# EAGLE schematic Rapid_Prototype_Schematic (EAGLE 9.6.2)

## Sheet 1 of 5
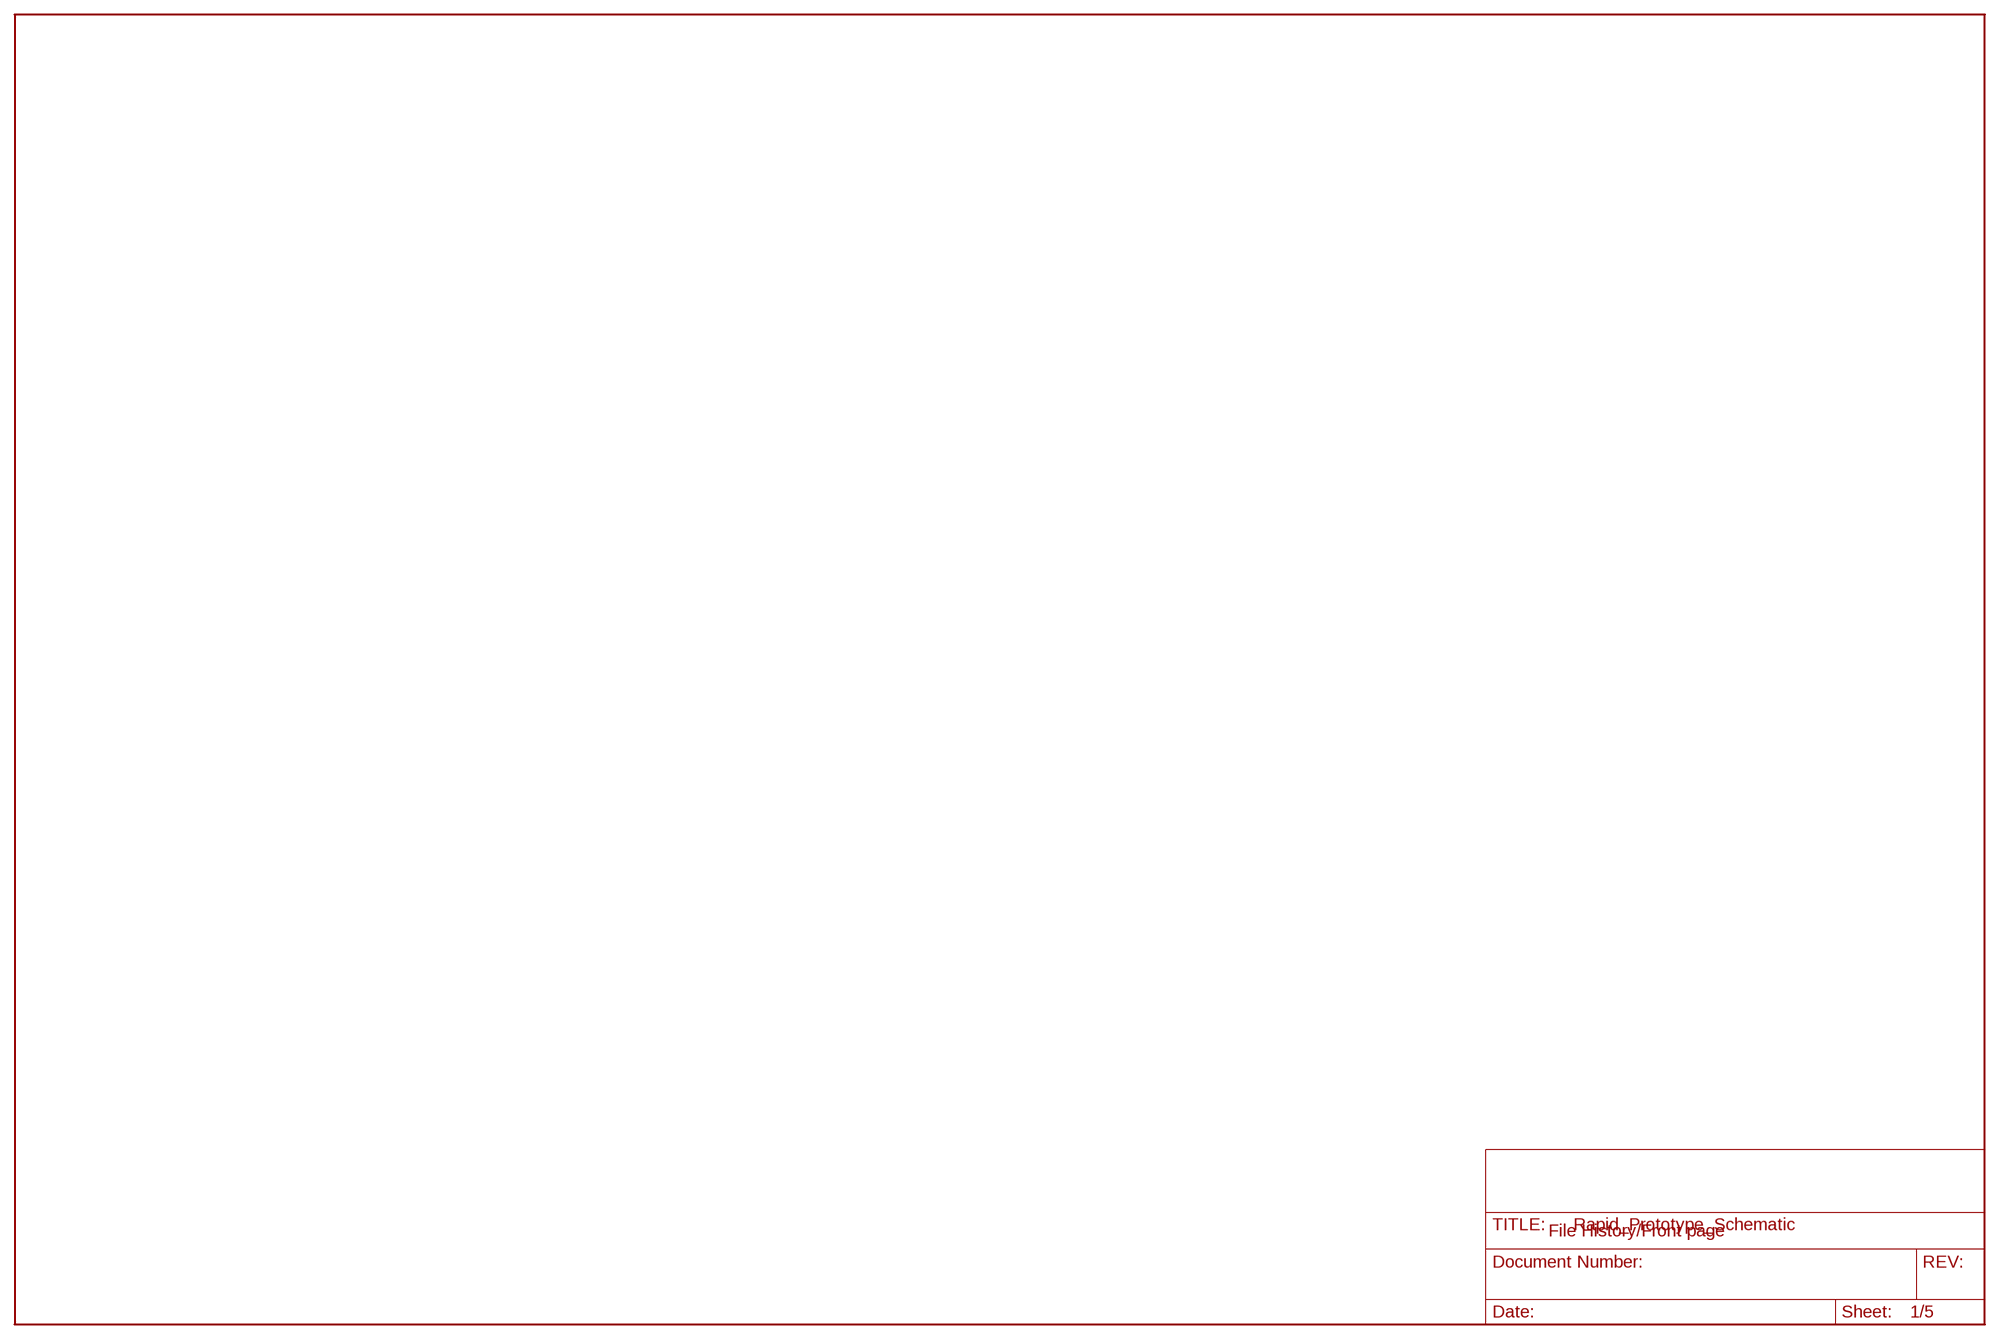
[diagram p0: schematic, sheet 1]

### Notes on the sheet
- File History/Front page

## Sheet 2 of 5
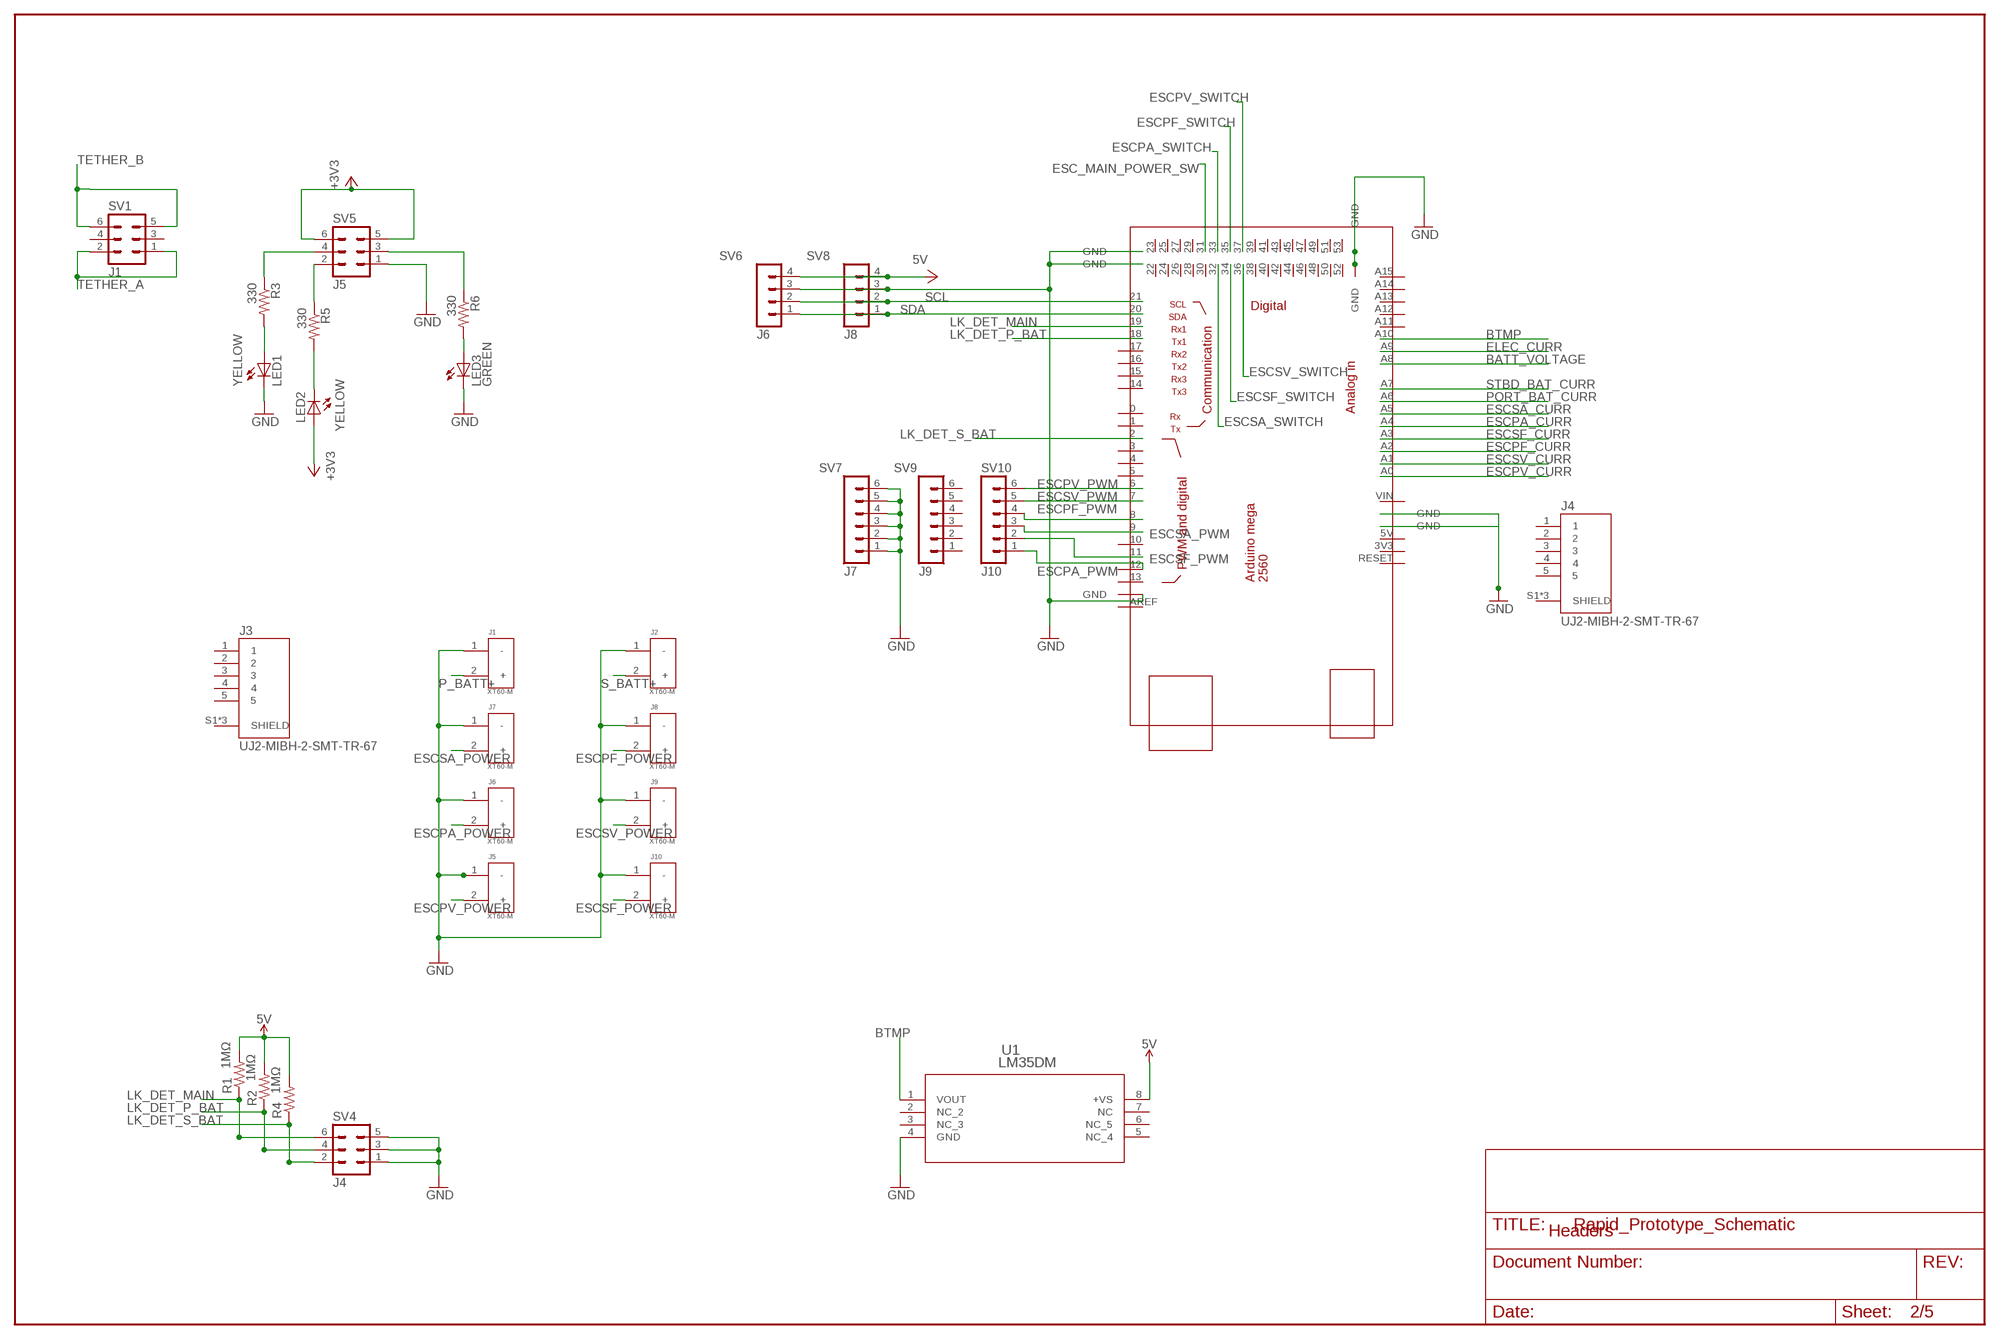
[diagram p1: schematic, sheet 2]

### Parts
$2_3_$_2020-06-04_21-52-10  MEGA_DEVICE  [MEGAOUTLINE]
J1  XT60-M  [AMASS_XT60-M]
J2  XT60-M  [AMASS_XT60-M]
J3  UJ2-MIBH-2-SMT-TR-67  [CUI_UJ2-MIBH-2-SMT-TR-67]
J4  UJ2-MIBH-2-SMT-TR-67  [CUI_UJ2-MIBH-2-SMT-TR-67]
J5  XT60-M  [AMASS_XT60-M]
J6  XT60-M  [AMASS_XT60-M]
J7  XT60-M  [AMASS_XT60-M]
J8  XT60-M  [AMASS_XT60-M]
J9  XT60-M  [AMASS_XT60-M]
J10  XT60-M  [AMASS_XT60-M]
LED1  YELLOW  LEDCHIPLED_0805  [CHIPLED_0805]
LED2  YELLOW  LEDCHIPLED_0805  [CHIPLED_0805]
LED3  GREEN  LEDCHIPLED_0805  [CHIPLED_0805]
R1  1MΩ  R-US_M0805  [M0805]
R2  1MΩ  R-US_M0805  [M0805]
R3  330  R-US_R0805  [R0805]
R4  1MΩ  R-US_M0805  [M0805]
R5  330  R-US_R0805  [R0805]
R6  330  R-US_R0805  [R0805]
SV1  J1  MA03-2  [MA03-2]
SV4  J4  MA03-2  [MA03-2]
SV5  J5  MA03-2  [MA03-2]
SV6  J6  MA04-1  [MA04-1]
SV7  J7  MA06-1  [MA06-1]
SV8  J8  MA04-1  [MA04-1]
SV9  J9  MA06-1  [MA06-1]
SV10  J10  MA06-1  [MA06-1]
U1  LM35DM  [M08A]

### Nets
5V: R1.2 R2.2 R4.2 U1.8(+VS) ; also sheet 3,4
+3V3: LED2.A SV5.5 SV5.6 ; also sheet 4
+5V: SV6.4 SV8.4 ; supply symbol labelled 5V ; also sheet 4
BATT_VOLTAGE: $2_3_$_2020-06-04_21-52-10.A8 ; also sheet 4
BTMP: $2_3_$_2020-06-04_21-52-10.A10 U1.1(VOUT)
ELEC_CURR: $2_3_$_2020-06-04_21-52-10.A9 ; also sheet 3
ESC_MAIN_POWER_SW: $2_3_$_2020-06-04_21-52-10.31 ; also sheet 5
ESCPA_CURR: $2_3_$_2020-06-04_21-52-10.A4 ; also sheet 3
ESCPA_POWER: J6.2(+) ; also sheet 5
ESCPA_PWM: $2_3_$_2020-06-04_21-52-10.12 SV10.1
ESCPA_SWITCH: $2_3_$_2020-06-04_21-52-10.33 ; also sheet 5
ESCPF_CURR: $2_3_$_2020-06-04_21-52-10.A2 ; also sheet 3
ESCPF_POWER: J8.2(+) ; also sheet 5
ESCPF_PWM: $2_3_$_2020-06-04_21-52-10.8 SV10.4
ESCPF_SWITCH: $2_3_$_2020-06-04_21-52-10.35 ; also sheet 5
ESCPV_CURR: $2_3_$_2020-06-04_21-52-10.A0 ; also sheet 3
ESCPV_POWER: J5.2(+) ; also sheet 5
ESCPV_PWM: $2_3_$_2020-06-04_21-52-10.6 SV10.6
ESCPV_SWITCH: $2_3_$_2020-06-04_21-52-10.37 ; also sheet 5
ESCSA_CURR: $2_3_$_2020-06-04_21-52-10.A5 ; also sheet 3
ESCSA_POWER: J7.2(+) ; also sheet 5
ESCSA_PWM: $2_3_$_2020-06-04_21-52-10.9 SV10.3
ESCSA_SWITCH: $2_3_$_2020-06-04_21-52-10.32 ; also sheet 5
ESCSF_CURR: $2_3_$_2020-06-04_21-52-10.A3 ; also sheet 3
ESCSF_POWER: J10.2(+) ; also sheet 5
ESCSF_PWM: $2_3_$_2020-06-04_21-52-10.11 SV10.2
ESCSF_SWITCH: $2_3_$_2020-06-04_21-52-10.34 ; also sheet 5
ESCSV_CURR: $2_3_$_2020-06-04_21-52-10.A1 ; also sheet 3
ESCSV_POWER: J9.2(+) ; also sheet 5
ESCSV_PWM: $2_3_$_2020-06-04_21-52-10.7 SV10.5
ESCSV_SWITCH: $2_3_$_2020-06-04_21-52-10.36 ; also sheet 5
GND: $2_3_$_2020-06-04_21-52-10.GND@1(GND) $2_3_$_2020-06-04_21-52-10.GND@2(GND) $2_3_$_2020-06-04_21-52-10.GND@3(GND) $2_3_$_2020-06-04_21-52-10.GND@4(GND) $2_3_$_2020-06-04_21-52-10.GND@5(GND) $2_3_$_2020-06-04_21-52-10.GND@6(GND) $2_3_$_2020-06-04_21-52-10.GND@7(GND) J1.1(-) J2.1(-) J5.1(-) J6.1(-) J7.1(-) J8.1(-) J9.1(-) J10.1(-) LED1.C LED3.C SV4.1 SV4.3 SV4.5 SV5.1 SV6.3 SV7.1 SV7.2 SV7.3 SV7.4 SV7.5 SV7.6 SV8.3 U1.4(GND) ; also sheet 3,4,5
LK_DET_MAIN: $2_3_$_2020-06-04_21-52-10.19 R1.1 SV4.6
LK_DET_P_BAT: $2_3_$_2020-06-04_21-52-10.18 R2.1 SV4.4
LK_DET_S_BAT: $2_3_$_2020-06-04_21-52-10.2 R4.1 SV4.2
N$53: R3.1 SV5.4
N$54: LED2.C R5.2
N$55: R5.1 SV5.2
N$56: LED1.A R3.2
N$57: R6.1 SV5.3
N$58: LED3.A R6.2
P_BATT+: J1.2(+) ; also sheet 4
PORT_BAT_CURR: $2_3_$_2020-06-04_21-52-10.A6 ; also sheet 4
S_BATT+: J2.2(+) ; also sheet 4
SCL: $2_3_$_2020-06-04_21-52-10.21 SV6.2 SV8.2
SDA: $2_3_$_2020-06-04_21-52-10.20 SV6.1 SV8.1
STBD_BAT_CURR: $2_3_$_2020-06-04_21-52-10.A7 ; also sheet 4
TETHER_A: SV1.1 SV1.2 ; also sheet 4
TETHER_B: SV1.5 SV1.6 ; also sheet 4
Unconnected: $2_3_$_2020-06-04_21-52-10.0 $2_3_$_2020-06-04_21-52-10.1 $2_3_$_2020-06-04_21-52-10.3 $2_3_$_2020-06-04_21-52-10.3V3 $2_3_$_2020-06-04_21-52-10.4 $2_3_$_2020-06-04_21-52-10.5 $2_3_$_2020-06-04_21-52-10.5V $2_3_$_2020-06-04_21-52-10.10 $2_3_$_2020-06-04_21-52-10.13 $2_3_$_2020-06-04_21-52-10.14 $2_3_$_2020-06-04_21-52-10.15 $2_3_$_2020-06-04_21-52-10.16 $2_3_$_2020-06-04_21-52-10.17 $2_3_$_2020-06-04_21-52-10.22 $2_3_$_2020-06-04_21-52-10.23 $2_3_$_2020-06-04_21-52-10.24 $2_3_$_2020-06-04_21-52-10.25 $2_3_$_2020-06-04_21-52-10.26 $2_3_$_2020-06-04_21-52-10.27 $2_3_$_2020-06-04_21-52-10.28 $2_3_$_2020-06-04_21-52-10.29 $2_3_$_2020-06-04_21-52-10.30 $2_3_$_2020-06-04_21-52-10.38 $2_3_$_2020-06-04_21-52-10.39 $2_3_$_2020-06-04_21-52-10.40 $2_3_$_2020-06-04_21-52-10.41 $2_3_$_2020-06-04_21-52-10.42 $2_3_$_2020-06-04_21-52-10.43 $2_3_$_2020-06-04_21-52-10.44 $2_3_$_2020-06-04_21-52-10.45 $2_3_$_2020-06-04_21-52-10.46 $2_3_$_2020-06-04_21-52-10.47 $2_3_$_2020-06-04_21-52-10.48 $2_3_$_2020-06-04_21-52-10.49 $2_3_$_2020-06-04_21-52-10.50 $2_3_$_2020-06-04_21-52-10.51 $2_3_$_2020-06-04_21-52-10.52 $2_3_$_2020-06-04_21-52-10.53 $2_3_$_2020-06-04_21-52-10.A11 $2_3_$_2020-06-04_21-52-10.A12 $2_3_$_2020-06-04_21-52-10.A13 $2_3_$_2020-06-04_21-52-10.A14 $2_3_$_2020-06-04_21-52-10.A15 $2_3_$_2020-06-04_21-52-10.AREF $2_3_$_2020-06-04_21-52-10.RESET $2_3_$_2020-06-04_21-52-10.VIN J3.1 J3.2 J3.3 J3.4 J3.5 J3.S1(SHIELD) J3.S2(SHIELD) J3.S3(SHIELD) J4.1 J4.2 J4.3 J4.4 J4.5 J4.S1(SHIELD) J4.S2(SHIELD) J4.S3(SHIELD) SV1.3 SV1.4 SV9.1 SV9.2 SV9.3 SV9.4 SV9.5 SV9.6 U1.2(NC_2) U1.3(NC_3) U1.5(NC_4) U1.6(NC_5) U1.7(NC)

### Notes on the sheet
- Headers

## Sheet 3 of 5
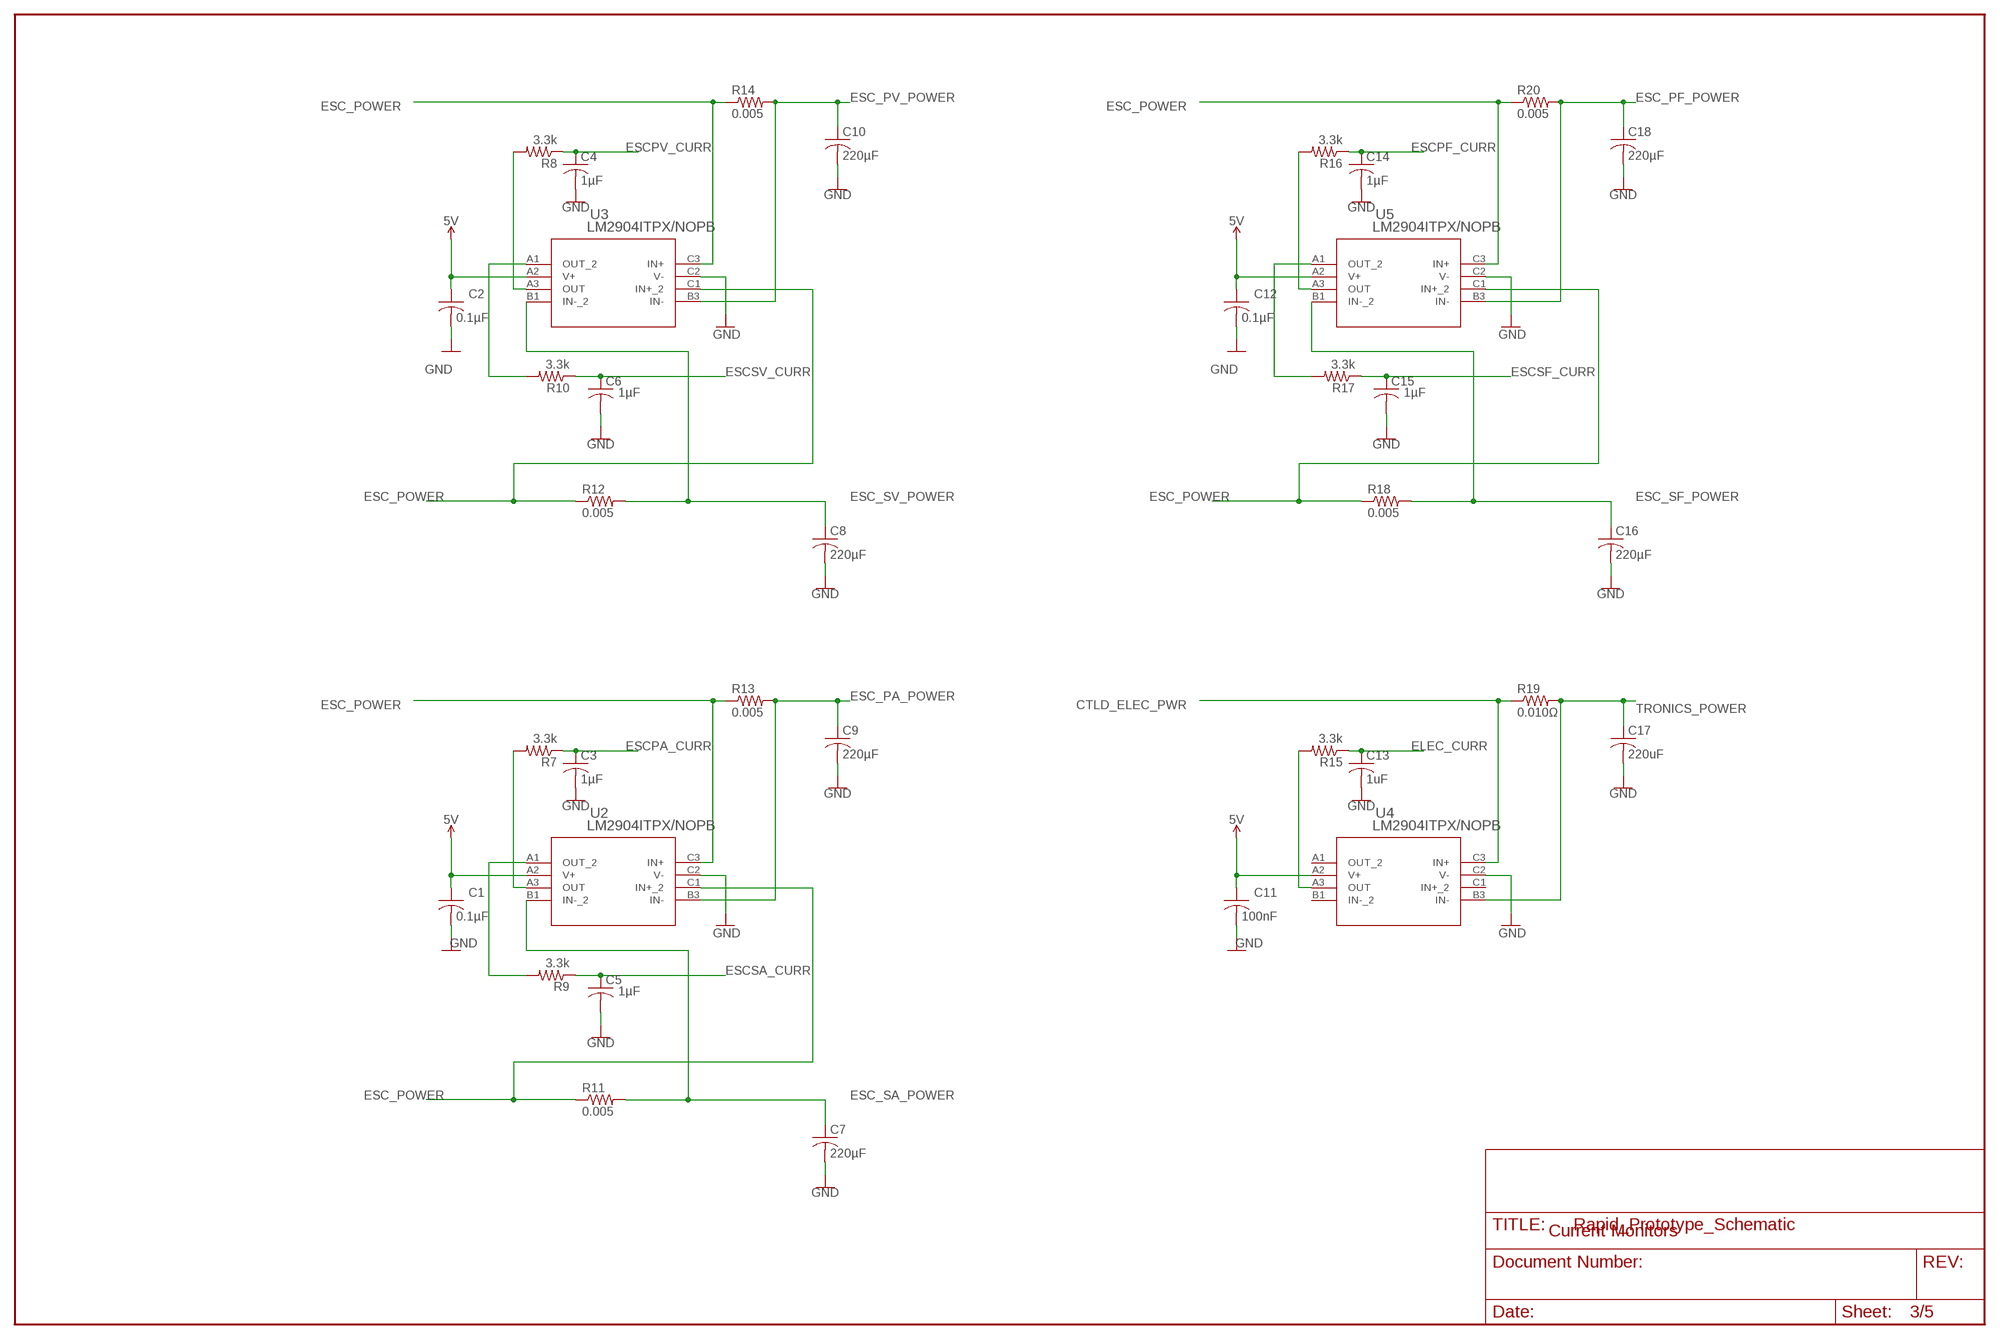
[diagram p2: schematic, sheet 3]

### Parts
C1  0.1µF  C-USC0603  [C0603]
C2  0.1µF  C-USC0603  [C0603]
C3  1µF  C-USC0805  [C0805]
C4  1µF  C-USC0805  [C0805]
C5  1µF  C-USC0805  [C0805]
C6  1µF  C-USC0805  [C0805]
C7  220µF  C-US050-050X075  [C050-050X075]
C8  220µF  C-US050-050X075  [C050-050X075]
C9  220µF  C-US050-050X075  [C050-050X075]
C10  220µF  C-US050-050X075  [C050-050X075]
C11  100nF  C-USC0603  [C0603]
C12  0.1µF  C-USC0603  [C0603]
C13  1uF  C-USC0805  [C0805]
C14  1µF  C-USC0805  [C0805]
C15  1µF  C-USC0805  [C0805]
C16  220µF  C-US050-050X075  [C050-050X075]
C17  220uF  C-US050-050X075  [C050-050X075]
C18  220µF  C-US050-050X075  [C050-050X075]
R7  3.3k  R-US_R0603  [R0603]
R8  3.3k  R-US_R0603  [R0603]
R9  3.3k  R-US_R0603  [R0603]
R10  3.3k  R-US_R0603  [R0603]
R11  0.005  R-US_R1206  [R1206]
R12  0.005  R-US_R1206  [R1206]
R13  0.005  R-US_R1206  [R1206]
R14  0.005  R-US_R1206  [R1206]
R15  3.3k  R-US_R0603  [R0603]
R16  3.3k  R-US_R0603  [R0603]
R17  3.3k  R-US_R0603  [R0603]
R18  0.005  R-US_R1206  [R1206]
R19  0.010Ω  R-US_R1206  [R1206]
R20  0.005  R-US_R1206  [R1206]
U2  LM2904ITPX/NOPB  [TPA08AAA]
U3  LM2904ITPX/NOPB  [TPA08AAA]
U4  LM2904ITPX/NOPB  [TPA08AAA]
U5  LM2904ITPX/NOPB  [TPA08AAA]

### Nets
5V: C1.1 C2.1 C11.1 C12.1 U2.A2(V+) U3.A2(V+) U4.A2(V+) U5.A2(V+) ; also sheet 2,4
CTLD_ELEC_PWR: R19.1 U4.C3(IN+) ; also sheet 4
ELEC_CURR: C13.1 R15.1 ; also sheet 2
ESC_PA_POWER: C9.1 R13.2 U2.B3(IN-) ; also sheet 5
ESC_PF_POWER: C18.1 R20.2 U5.B3(IN-) ; also sheet 5
ESC_POWER: R11.1 R12.1 R13.1 R14.1 R18.1 R20.1 U2.C1(IN+_2) U2.C3(IN+) U3.C1(IN+_2) U3.C3(IN+) U5.C1(IN+_2) U5.C3(IN+) ; also sheet 5
ESC_PV_POWER: C10.1 R14.2 U3.B3(IN-) ; also sheet 5
ESC_SA_POWER: C7.1 R11.2 U2.B1(IN-_2) ; also sheet 5
ESC_SF_POWER: C16.1 R18.2 U5.B1(IN-_2) ; also sheet 5
ESC_SV_POWER: C8.1 R12.2 U3.B1(IN-_2) ; also sheet 5
ESCPA_CURR: C3.1 R7.1 ; also sheet 2
ESCPF_CURR: C14.1 R16.1 ; also sheet 2
ESCPV_CURR: C4.1 R8.1 ; also sheet 2
ESCSA_CURR: C5.1 R9.1 ; also sheet 2
ESCSF_CURR: C15.1 R17.1 ; also sheet 2
ESCSV_CURR: C6.1 R10.1 ; also sheet 2
GND: C1.2 C2.2 C3.2 C4.2 C5.2 C6.2 C7.2 C8.2 C9.2 C10.2 C11.2 C12.2 C13.2 C14.2 C15.2 C16.2 C17.2 C18.2 U2.C2(V-) U3.C2(V-) U4.C2(V-) U5.C2(V-) ; also sheet 2,4,5
N$1: R8.2 U3.A3(OUT)
N$2: R16.2 U5.A3(OUT)
N$5: R10.2 U3.A1(OUT_2)
N$7: R17.2 U5.A1(OUT_2)
N$9: R7.2 U2.A3(OUT)
N$11: R9.2 U2.A1(OUT_2)
N$36: R15.2 U4.A3(OUT)
TRONICS_POWER: C17.1 R19.2 U4.B3(IN-) ; also sheet 4
Unconnected: U4.A1(OUT_2) U4.B1(IN-_2) U4.C1(IN+_2)

### Notes on the sheet
- Current Monitors

## Sheet 4 of 5
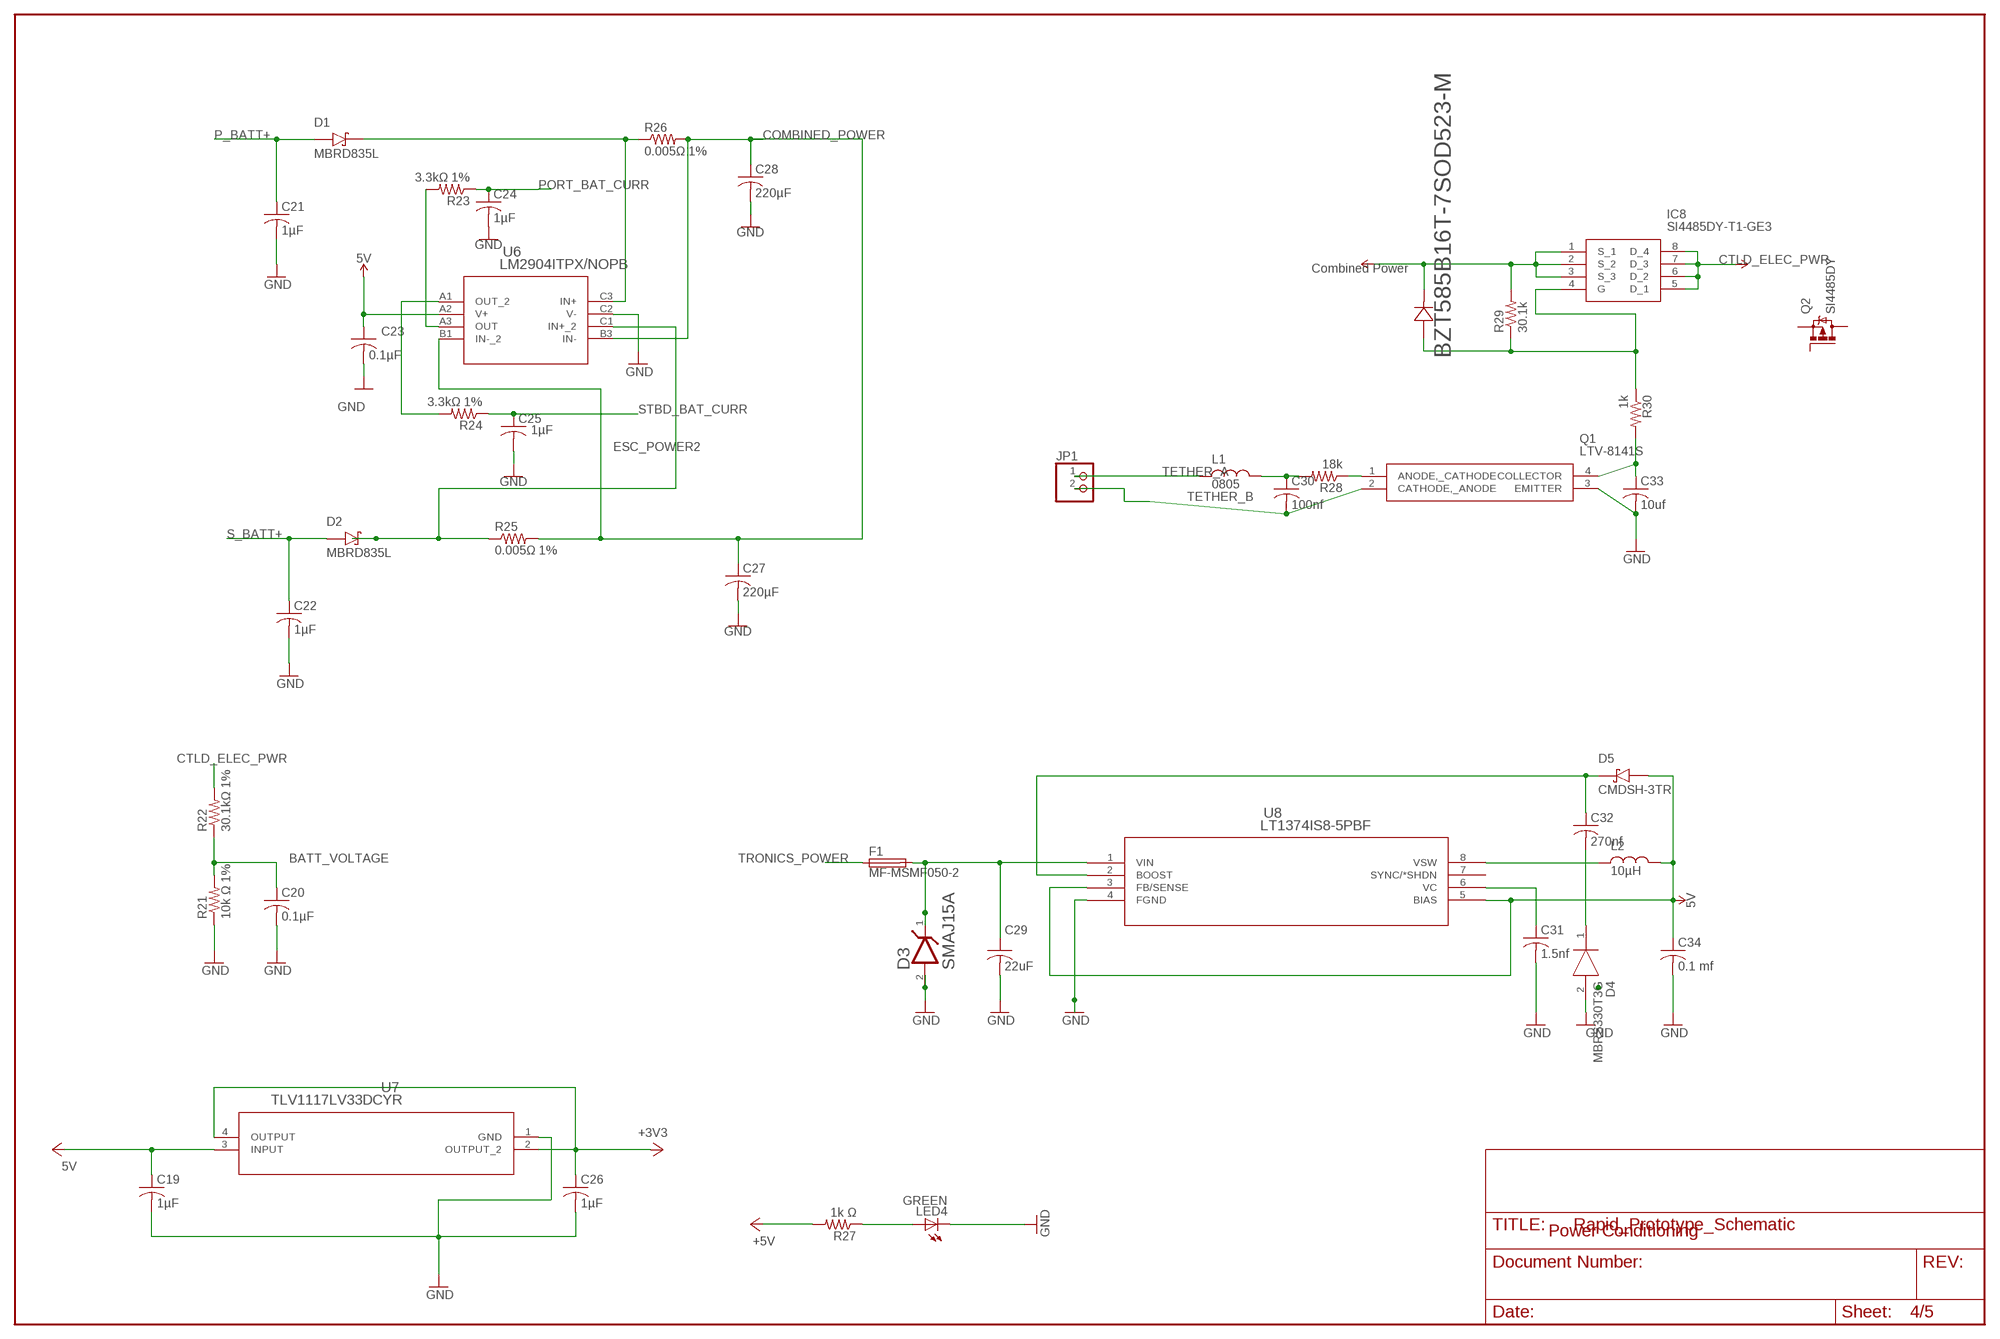
[diagram p3: schematic, sheet 4]

### Parts
C19  1µF  C-USC0805  [C0805]
C20  0.1µF  C-USC0603  [C0603]
C21  1µF  C-USC0603  [C0603]
C22  1µF  C-USC0603  [C0603]
C23  0.1µF  C-USC0603  [C0603]
C24  1µF  C-USC0805  [C0805]
C25  1µF  C-USC0805  [C0805]
C26  1µF  C-USC0805  [C0805]
C27  220µF  C-US050-050X075  [C050-050X075]
C28  220µF  C-US050-050X075  [C050-050X075]
C29  22uF  C-USC1206  [C1206]
C30  100nf  C-USC0603  [C0603]
C31  1.5nf  C-USC1206  [C1206]
C32  270nf  C-USC0603  [C0603]
C33  10uf  C-USC0603  [C0603]
C34  0.1 mf  C-USC0603  [C0603]
CR1  BZT585B16T-7SOD523-M  [SOD523-M]
D1  MBRD835L  [DPAK229P990X238-3N]
D2  MBRD835L  [DPAK229P990X238-3N]
D3  BOURNS_INC._SMAJ15ABOURNS_INC._SMAJ15A_0_0  [BOURNS_INC._SMAJ15A_0]
D4  MBRS330T3G  [DIOM7958X256N]
D5  CMDSH-3TR  [SOD2512X110N]
F1  MF-MSMF050-2  [FUSM1812X02]
IC8  SI4485DY-T1-GE3  [SOIC127P600X175-8N]
JP1  PINHD-1X2  [1X02]
L1  0805  L  (no package)
L2  10µH  L  (no package)
LED4  GREEN  LEDCHIPLED_0805  [CHIPLED_0805]
Q1  LTV-8141S  [SOP254P1016X460-4N]
R21  10k Ω 1%  R-US_M0805  [M0805]
R22  30.1kΩ 1%  R-US_M0805  [M0805]
R23  3.3kΩ 1%  R-US_R0603  [R0603]
R24  3.3kΩ 1%  R-US_R0603  [R0603]
R25  0.005Ω 1%  R-US_R1206  [R1206]
R26  0.005Ω 1%  R-US_R1206  [R1206]
R27  1k Ω  R-US_M0805  [M0805]
R28  18k  R-US_M0805  [M0805]
R29  30.1k  R-US_M0805  [M0805]
R30  1k  R-US_M0805  [M0805]
U6  LM2904ITPX/NOPB  [TPA08AAA]
U7  TLV1117LV33DCYR  [DCY4]
U8  LT1374IS8-5PBF  [SO-8_S]

### Nets
5V: C23.1 C34.1 CR1.1 D5.A IC8.1(S_1) IC8.2(S_2) IC8.3(S_3) IC8.5(D_1) IC8.6(D_2) IC8.7(D_3) IC8.8(D_4) L2.2 R29.2 U6.A2(V+) U8.3(FB/SENSE) U8.5(BIAS) ; supply symbol labelled Combined Power, CTLD_ELEC_PWR ; also sheet 2,3
+3V3: C26.1 U7.2(OUTPUT_2) U7.4(OUTPUT) ; also sheet 2
+5V: C19.1 R27.2 U7.3(INPUT) ; supply symbol labelled 5V ; also sheet 2
BATT_VOLTAGE: C20.1 R21.2 R22.1 ; also sheet 2
COMBINED_POWER: C27.1 C28.1 R25.2 R26.2 U6.B1(IN-_2) U6.B3(IN-) ; also sheet 5
CTLD_ELEC_PWR: R22.2 ; also sheet 3
ESC_POWER1: D1.4(K) R26.1 U6.C3(IN+)
ESC_POWER2: D2.4(K) R25.1 U6.C1(IN+_2)
GND: C19.2 C20.2 C21.2 C22.2 C23.2 C24.2 C25.2 C26.2 C27.2 C28.2 C29.2 C31.2 C33.2 C34.2 D3.2(ANODE) D4.2(A) LED4.C Q1.3(EMITTER) R21.1 U6.C2(V-) U7.1(GND) U8.4(FGND) ; also sheet 2,3,5
N$3: L2.1 U8.8(VSW)
N$4: C31.1 U8.6(VC)
N$8: C32.2 D4.1(K)
N$16: Q1.1(ANODE,_CATHODE) R28.1
N$34: R23.2 U6.A3(OUT)
N$35: R24.2 U6.A1(OUT_2)
N$37: C29.1 D3.1(CATHODE) F1.2 U8.1(VIN)
N$38: C32.1 D5.C U8.2(BOOST)
N$39: LED4.A R27.1
N$43: CR1.2 IC8.4(G) R29.1 R30.1
N$44: C33.1 Q1.4(COLLECTOR) R30.2
N$48: C30.1 L1.2 R28.2
P_BATT+: C21.1 D1.1(A) D1.3(A) ; also sheet 2
PORT_BAT_CURR: C24.1 R23.1 ; also sheet 2
S_BATT+: C22.1 D2.1(A) D2.3(A) ; also sheet 2
STBD_BAT_CURR: C25.1 R24.1 ; also sheet 2
TETHER_A: JP1.1 L1.1 ; also sheet 2
TETHER_B: C30.2 JP1.2 Q1.2(CATHODE,_ANODE) ; also sheet 2
TRONICS_POWER: F1.1 ; also sheet 3
Unconnected: U8.7(SYNC/*SHDN)

### Notes on the sheet
- Power Conditioning

## Sheet 5 of 5
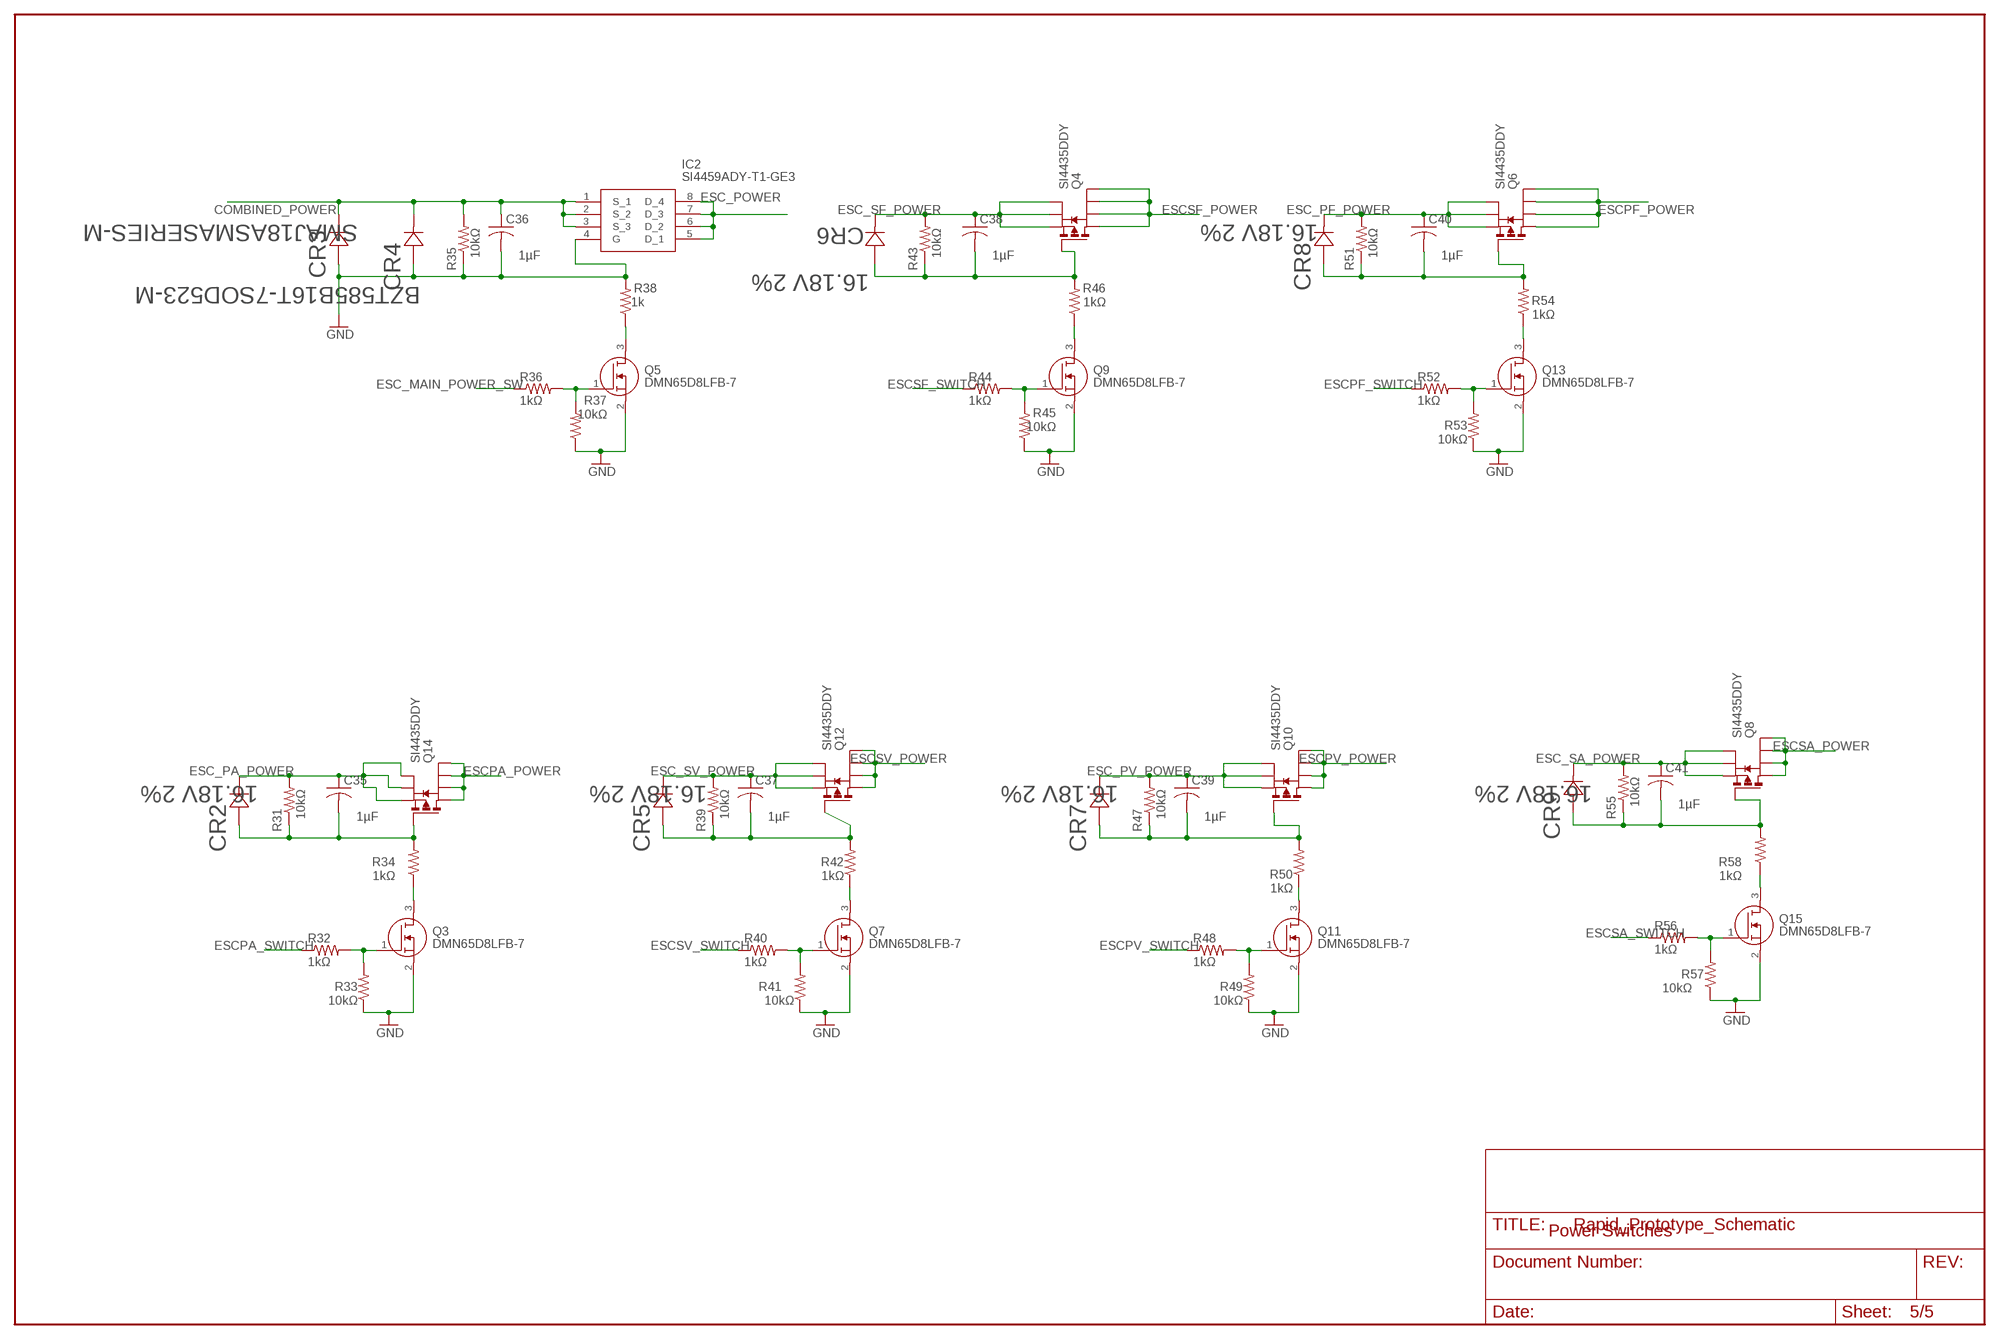
[diagram p4: schematic, sheet 5]

### Parts
C35  1µF  C-USC0805  [C0805]
C36  1µF  C-USC0805  [C0805]
C37  1µF  C-USC0805  [C0805]
C38  1µF  C-USC0805  [C0805]
C39  1µF  C-USC0805  [C0805]
C40  1µF  C-USC0805  [C0805]
C41  1µF  C-USC0805  [C0805]
CR2  16.18V 2%  BZT585B16T-7SOD523-M  [SOD523-M]
CR3  SMAJ18ASMASERIES-M  [SMASERIES-M]
CR4  BZT585B16T-7SOD523-M  [SOD523-M]
CR5  16.18V 2%  BZT585B16T-7SOD523-M  [SOD523-M]
CR6  16.18V 2%  BZT585B16T-7SOD523-M  [SOD523-M]
CR7  16.18V 2%  BZT585B16T-7SOD523-M  [SOD523-M]
CR8  16.18V 2%  BZT585B16T-7SOD523-M  [SOD523-M]
CR9  16.18V 2%  BZT585B16T-7SOD523-M  [SOD523-M]
IC2  SI4459ADY-T1-GE3  [SOIC127P600X175-8N]
Q3  DMN65D8LFB-7  [DESD6V8DLP7]
Q4  SI4435DDY  [SO-8]
Q5  DMN65D8LFB-7  [DESD6V8DLP7]
Q6  SI4435DDY  [SO-8]
Q7  DMN65D8LFB-7  [DESD6V8DLP7]
Q8  SI4435DDY  [SO-8]
Q9  DMN65D8LFB-7  [DESD6V8DLP7]
Q10  SI4435DDY  [SO-8]
Q11  DMN65D8LFB-7  [DESD6V8DLP7]
Q12  SI4435DDY  [SO-8]
Q13  DMN65D8LFB-7  [DESD6V8DLP7]
Q14  SI4435DDY  [SO-8]
Q15  DMN65D8LFB-7  [DESD6V8DLP7]
R31  10kΩ  R-US_R0603  [R0603]
R32  1kΩ  R-US_R0603  [R0603]
R33  10kΩ  R-US_R0603  [R0603]
R34  1kΩ  R-US_R0603  [R0603]
R35  10kΩ  R-US_R0603  [R0603]
R36  1kΩ  R-US_R0603  [R0603]
R37  10kΩ  R-US_R0603  [R0603]
R38  1k  R-US_R0603  [R0603]
R39  10kΩ  R-US_R0603  [R0603]
R40  1kΩ  R-US_R0603  [R0603]
R41  10kΩ  R-US_R0603  [R0603]
R42  1kΩ  R-US_R0603  [R0603]
R43  10kΩ  R-US_R0603  [R0603]
R44  1kΩ  R-US_R0603  [R0603]
R45  10kΩ  R-US_R0603  [R0603]
R46  1kΩ  R-US_R0603  [R0603]
R47  10kΩ  R-US_R0603  [R0603]
R48  1kΩ  R-US_R0603  [R0603]
R49  10kΩ  R-US_R0603  [R0603]
R50  1kΩ  R-US_R0603  [R0603]
R51  10kΩ  R-US_R0603  [R0603]
R52  1kΩ  R-US_R0603  [R0603]
R53  10kΩ  R-US_R0603  [R0603]
R54  1kΩ  R-US_R0603  [R0603]
R55  10kΩ  R-US_R0603  [R0603]
R56  1kΩ  R-US_R0603  [R0603]
R57  10kΩ  R-US_R0603  [R0603]
R58  1kΩ  R-US_R0603  [R0603]

### Nets
COMBINED_POWER: C36.1 CR3.1 CR4.1 IC2.1(S_1) IC2.2(S_2) IC2.3(S_3) R35.2 ; also sheet 4
ESC_MAIN_POWER_SW: R36.1 ; also sheet 2
ESC_PA_POWER: C35.1 CR2.1 Q14.1(S) Q14.2(S) Q14.3(S) R31.2 ; also sheet 3
ESC_PF_POWER: C40.1 CR8.1 Q6.1(S) Q6.2(S) Q6.3(S) R51.2 ; also sheet 3
ESC_POWER: IC2.5(D_1) IC2.6(D_2) IC2.7(D_3) IC2.8(D_4) ; also sheet 3
ESC_PV_POWER: C39.1 CR7.1 Q10.1(S) Q10.2(S) Q10.3(S) R47.2 ; also sheet 3
ESC_SA_POWER: C41.1 CR9.1 Q8.1(S) Q8.2(S) Q8.3(S) R55.2 ; also sheet 3
ESC_SF_POWER: C38.1 CR6.1 Q4.1(S) Q4.2(S) Q4.3(S) R43.2 ; also sheet 3
ESC_SV_POWER: C37.1 CR5.1 Q12.1(S) Q12.2(S) Q12.3(S) R39.2 ; also sheet 3
ESCPA_POWER: Q14.5(D) Q14.6(D) Q14.7(D) Q14.8(D) ; also sheet 2
ESCPA_SWITCH: R32.1 ; also sheet 2
ESCPF_POWER: Q6.5(D) Q6.6(D) Q6.7(D) Q6.8(D) ; also sheet 2
ESCPF_SWITCH: R52.1 ; also sheet 2
ESCPV_POWER: Q10.5(D) Q10.6(D) Q10.7(D) Q10.8(D) ; also sheet 2
ESCPV_SWITCH: R48.1 ; also sheet 2
ESCSA_POWER: Q8.5(D) Q8.6(D) Q8.7(D) Q8.8(D) ; also sheet 2
ESCSA_SWITCH: R56.1 ; also sheet 2
ESCSF_POWER: Q4.5(D) Q4.6(D) Q4.7(D) Q4.8(D) ; also sheet 2
ESCSF_SWITCH: R44.1 ; also sheet 2
ESCSV_POWER: Q12.5(D) Q12.6(D) Q12.7(D) Q12.8(D) ; also sheet 2
ESCSV_SWITCH: R40.1 ; also sheet 2
GND: C36.2 CR3.2 CR4.2 IC2.4(G) Q3.2(S) Q5.2(S) Q7.2(S) Q9.2(S) Q11.2(S) Q13.2(S) Q15.2(S) R33.1 R35.1 R37.1 R38.2 R41.1 R45.1 R49.1 R53.1 R57.1 ; also sheet 2,3,4
N$10: Q3.1(G) R32.2 R33.2
N$12: C40.2 CR8.2 Q6.4(G) R51.1 R54.2
N$13: C35.2 CR2.2 Q14.4(G) R31.1 R34.2
N$15: Q5.3(D) R38.1
N$17: Q5.1(G) R36.2 R37.2
N$18: Q3.3(D) R34.1
N$19: C37.2 CR5.2 Q12.4(G) R39.1 R42.2
N$20: Q7.1(G) R40.2 R41.2
N$21: Q7.3(D) R42.1
N$22: C39.2 CR7.2 Q10.4(G) R47.1 R50.2
N$23: Q11.1(G) R48.2 R49.2
N$24: Q11.3(D) R50.1
N$25: C41.2 CR9.2 Q8.4(G) R55.1 R58.2
N$26: Q15.1(G) R56.2 R57.2
N$27: Q15.3(D) R58.1
N$29: Q13.1(G) R52.2 R53.2
N$30: Q13.3(D) R54.1
N$31: C38.2 CR6.2 Q4.4(G) R43.1 R46.2
N$32: Q9.1(G) R44.2 R45.2
N$33: Q9.3(D) R46.1

### Notes on the sheet
- Power Switches

## Library data of the parts
$2_3_$_2020-06-04_21-52-10 = ArduinoMegaOutline:MEGA_DEVICE: mega card as device
C1-C41 = adafruit:C-US: CAPACITOR, American symbol
CR1 CR2 CR4-CR9 = Diode1:BZT585B16T-7; MANUFACTURER_PART_NUMBER: BZT585B16T7; VENDOR: Diodes Inc
CR3 = Diode2:SMAJ18A; MANUFACTURER_PART_NUMBER: SMAJ18A; VENDOR: Littelfuse Inc
D1 D2 = MBRD835L:MBRD835L: schottky, diode, Schottky Diodes, Diodes, Discretes (diodes, transistors, thyristors ...), Semiconductors and Actives; AVAILABILITY: Unavailable; DESCRIPTION: Diode Schottky 35V 8A Surface Mount DPAK; MF: Diodes Inc.; MP: MBRD835L-T; PACKAGE: TO-252 Diodes Inc.; PRICE: None
D3 = Bourns Inc. - SMAJ15A:BOURNS_INC._SMAJ15A: 24.4V Clamp 16.4A Ipp Tvs Diode Surface Mount SMA (DO-214AC); AUTOMOTIVE: No; BREAKDOWN_VOLTAGE: 16.7V; CENTROID_NOT_SPECIFIED: No; CLAMPING_VOLTAGE: 24.4V; DATASHEET: https://www.bourns.com/docs/Product-Datasheets/SMAJ.pdf; DEVICE_CLASS_L1: Circuit Protection; DEVICE_CLASS_L2: TVS Diodes; DEVICE_CLASS_L3: unset; DIGIKEY_DESCRIPTION: DIODE TVS DIODE 15V 24.4V SMA; DIGIKEY_PART_NUMBER: SMAJ15ABCT-ND; DIRECTION: Unidirectional; FOOTPRINT_VARIANT_NAME_0: Recommended_Land_Pattern; HEIGHT: 2.29mm; LEAD_FREE: Yes; MAX_JUNCTION_TEMP: +150°C; MF: Bourns Inc.; MFG_PACKAGE_IDENT: SMA; MFG_PACKAGE_IDENT_COMPONENT_ID: c691c3592a14e60a; MFG_PACKAGE_IDENT_DATE: 0; MFG_PACKAGE_IDENT_REV: 0; MOUSER_DESCRIPTION: Bourns Smaj15a / Diode Tvs 15v 400w Uni 5% Smd Bourns; MOUSER_PART_NUMBER: 652-SMAJ15A; MPN: SMAJ15A; NUMBER_OF_CHANNELS: 1; PACKAGE: SMA; PEAK_PULSE_CURRENT: 16.4A; PEAK_PULSE_POWER: 400W; PREFIX: D; REVERSE_STANDOFF_VOLTAGE: 15V; ROHS: Yes; TEMPERATURE_RANGE_HIGH: +150°C; TEMPERATURE_RANGE_LOW: -55°C; VERIFICATION_VERSION: 0.0.0.3
D4 = MBRS330T3G:MBRS330T3G: Source: Datasheet <http://www.onsemi.com/pub/Collateral/MBRS340T3-D.PDF>; HEIGHT: 2.56mm; MANUFACTURER_NAME: ON Semiconductor; MANUFACTURER_PART_NUMBER: MBRS330T3G; MOUSER_PART_NUMBER: 863-MBRS330T3G; MOUSER_PRICE-STOCK: https://www.mouser.com/Search/Refine.aspx?Keyword=863-MBRS330T3G
D5 = CMDSH-3TR:CMDSH-3TR: CMDSH Series 30 V 100 mA Surface Mount Schottky Diode - SOD-323; AVAILABILITY: Unavailable; DESCRIPTION: Diode Schottky 30V 100mA Surface Mount SOD-323; MF: Central Semiconductor; MP: CMDSH-3 TR; PACKAGE: SOD-323 Central Semiconductor; PRICE: None
F1 = MF-MSMF050-2:MF-MSMF050-2: PTC Resettable Fuse 0.5A(hold) 1A(trip) 15V 100A 0.8W 0.15s 0.15Ohm SMD Solder Pad 1812 T/R; AVAILABILITY: Unavailable; DESCRIPTION: Polymeric PTC Resettable Fuse 15V 500mA Ih Surface Mount 1812 _4532 Metric_, Concave; MF: Bourns; MP: MF-MSMF050-2; PACKAGE: 1812 Bourns; PRICE: None
IC2 = SI4459ADY-T1-GE3:SI4459ADY-T1-GE3: Trans MOSFET P-CH 30V 29A 8-Pin SOIC N T/R Source: Datasheet <http://www.vishay.com/docs/69979/si4459ad.pdf>; DESCRIPTION: Trans MOSFET P-CH 30V 29A 8-Pin SOIC N T/R; HEIGHT: 1.75mm; MANUFACTURER_NAME: Vishay; MANUFACTURER_PART_NUMBER: SI4459ADY-T1-GE3; MOUSER_PART_NUMBER: 781-SI4459ADY-T1-GE3; MOUSER_PRICE-STOCK: https://www.mouser.co.uk/ProductDetail/Vishay-Semiconductors/SI4459ADY-T1-GE3?qs=IRuQNBqMOcnyBuDcl66N0Q%3D%3D
IC8 = SI4485DY-T1-GE3:SI4485DY-T1-GE3: MOSFET 30V 6.0A 5.0W 42mohm @ 10V Source: Datasheet <https://www.arrow.com/en/products/si4485dy-t1-ge3/vishay>; DESCRIPTION: MOSFET 30V 6.0A 5.0W 42mohm @ 10V; HEIGHT: 1.75mm; MANUFACTURER_NAME: Vishay; MANUFACTURER_PART_NUMBER: SI4485DY-T1-GE3; MOUSER_PART_NUMBER: 781-SI4485DY-T1-GE3; MOUSER_PRICE-STOCK: https://www.mouser.co.uk/ProductDetail/Vishay-Semiconductors/SI4485DY-T1-GE3?qs=yQ4lPMPRQIrw%2Fu7lX1YS%2Fw%3D%3D
J1 J2 J5-J10 = XT60-M:XT60-M: DC supply; XT60; male; PIN:2; for cable; soldered; 60A; 500V; AVAILABILITY: Unavailable; DESCRIPTION: Plug; DC supply; XT60; male; PIN: 2; for cable; soldered; 30A; 500V; MF: AMASS; MP: XT60-M; PACKAGE: Package; PRICE: None
J3 J4 = UJ2-MIBH-2-SMT-TR-67:UJ2-MIBH-2-SMT-TR-67; MANUFACTURER: CUI Inc; PARTREV: C; STANDARD: Manufacturer recommendations
JP1 = pinhead:PINHD-1X2: PIN HEADER
L1 L2 = ngspice-simulation:L: INDUCTOR
LED1-LED4 = adafruit:LED: LED OSRAM: - CHIPLED LG R971, LG N971, LY N971, LG Q971, LY Q971, LO R971, LY R971 LH N974, LH R974 LS Q976, LO Q976, LY Q976 LO Q996 - Hyper CHIPLED LW Q18S LB Q993, LB Q99A, LB R99A - SideLED LS A670, LO A670, LY A670, LG A670, LP A670 LB A673, LV A673, LT A673, LW A673 LH A674 LY A675 LS A676, LA A676, LO A676, LY A676, LW A676 LS A679, LY A679, LG A679 - Hyper Micro SIDELED® LS Y876, LA Y876, LO Y876, LY Y876 LT Y87S - SmartLED LW L88C, LW L88S LB L89C, LB L89S, LG L890 LS L89K, LO L89K, LY L89K LS L896, LA L896, LO L896, LY L896 - TOPLED LS T670, LO T670, LY T670, LG T670, LP T670 LSG T670, LSP T670, LSY T670, LOP T670, LYG T670 LG T671, LOG T671, LSG T671 LB T673, LV T673, LT T673, LW T673 LH T674 LS T676, LA T676, LO T676, LY T676, LB T676, LH T676, LSB T676, LW T676 LB T67C, LV T67C, LT T67C, LS T67K, LO T67K, LY T67K, LW E67C LS E67B, LA E67B, LO E67B, LY E67B, LB E67C, LV E67C, LT E67C LW T67C LS T679, LY T679, LG T679 LS T770, LO T770, LY T770, LG T770, LP T770 LB T773, LV T773, LT T773, LW T773 LH T774 LS E675, LA E675, LY E675, LS T675 LS T776, LA T776, LO T776, LY T776, LB T776 LHGB T686 LT T68C, LB T68C - Hyper Mini TOPLED® LB M676 - Mini TOPLED Santana® LG M470 LS M47K, LO M47K, LY M47K Source: http://www.osram.convergy.de/
Q1 = LTV-8141S:LTV-8141S: Transistor Output Optocouplers Optocoupler AC input Source: Datasheet <https://media.digikey.com/pdf/Data Sheets/Lite-On PDFs/LTV-8141_8241_8441 (M,S,S_TA1).pdf>; DESCRIPTION: Transistor Output Optocouplers Optocoupler AC input; HEIGHT: 4.6mm; MANUFACTURER_NAME: Lite-On; MANUFACTURER_PART_NUMBER: LTV-8141S; MOUSER_PART_NUMBER: 859-LTV-8141S; MOUSER_PRICE-STOCK: https://www.mouser.co.uk/ProductDetail/Lite-On/LTV-8141S?qs=9PJrLaO2oWUf6ygS0H3swQ%3D%3D
Q3 Q5 Q7 Q9 Q11 Q13 Q15 = DMN65D8LFB-7:DMN65D8LFB-7: MOSFET 60V N-Ch Dual Enh 20Vgss 300mW Pd Source: Datasheet <https://componentsearchengine.com/Datasheets/1/DMN65D8LFB-7.pdf>; DESCRIPTION: MOSFET 60V N-Ch Dual Enh 20Vgss 300mW Pd; HEIGHT: 0.53mm; MANUFACTURER_NAME: Diodes Inc.; MANUFACTURER_PART_NUMBER: DMN65D8LFB-7; MOUSER_PART_NUMBER: 621-DMN65D8LFB-7; MOUSER_PRICE-STOCK: https://www.mouser.com/Search/Refine.aspx?Keyword=621-DMN65D8LFB-7
Q4 Q6 Q8 Q10 Q12 Q14 = SI4435DDY:SI4435DDY; DESCRIPTION: P-Channel 30V 11.4A (Tc) 2.5W (Ta), 5W (Tc) Surface Mount 8-SO; MF: Vishay Siliconix; MP: SI4435DDY; PACKAGE: SOIC-8 Vishay Siliconix
R1-R58 = adafruit:R-US_: RESISTOR, American symbol
SV1 SV4 SV5 = con-lstb:MA03-2: PIN HEADER; OC_FARNELL: unknown; OC_NEWARK: unknown
SV6 SV8 = con-lstb:MA04-1: PIN HEADER; OC_FARNELL: unknown; OC_NEWARK: unknown
SV7 SV9 SV10 = con-lstb:MA06-1: PIN HEADER; OC_FARNELL: unknown; OC_NEWARK: unknown
U1 = LM35DM:LM35DM; BUILT_BY: EMA_UL_Team; MANUFACTURER_PART_NUMBER: LM35DM; VENDOR: Texas Instruments
U2-U6 = Opamp1:LM2904ITPX/NOPB: Test This is an opamp....; MANUFACTURER_PART_NUMBER: LM2904ITPXNOPB; VENDOR: Texas Instruments
U7 = TLV1117LV33DCYR:TLV1117LV33DCYR; BUILT_BY: EMA_UL_Team; MANUFACTURER: Texas Instruments; MANUFACTURER_PART_NUMBER: TLV1117LV33DCYR; VENDOR: Texas Instruments
U8 = LT1374IS8-5PBF:LT1374IS8-5PBF; AVAILABILITY: Unavailable; DESCRIPTION: Buck, SEPIC Switching Regulator IC Positive Fixed 5V 1 Output 4.5A _Switch_ 8-SOIC _0.154, 3.90mm Width_; MF: Linear Technology; MP: LT1374IS8-5#PBF; PACKAGE: SO-8 Linear Technology; PRICE: None